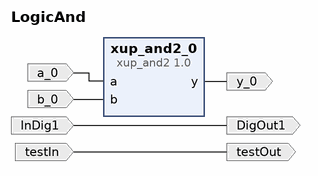
[diagram p0: block diagram of the top level]
# Vivado block design LogicAnd, xc7a35tcpg236-1, Vivado 2018.3
create_bd_design LogicAnd

create_bd_port -dir I a_0
create_bd_port -dir I b_0
create_bd_port -dir O y_0
create_bd_port -dir I InDig1
create_bd_port -dir O DigOut1
create_bd_port -dir I testIn
create_bd_port -dir O testOut

create_bd_cell -type ip -vlnv xilinx.com:xup:xup_and2:1.0 xup_and2_0

# ---- connections ----

connect_bd_net -net a_0_1 [get_bd_ports a_0] [get_bd_pins xup_and2_0/a]
connect_bd_net -net InDig1_1 [get_bd_ports InDig1] [get_bd_ports DigOut1]
connect_bd_net -net b_0_1 [get_bd_ports b_0] [get_bd_pins xup_and2_0/b]
connect_bd_net [get_bd_pins xup_and2_0/y] [get_bd_ports y_0]
connect_bd_net [get_bd_ports testIn] [get_bd_ports testOut]

validate_bd_design
save_bd_design
